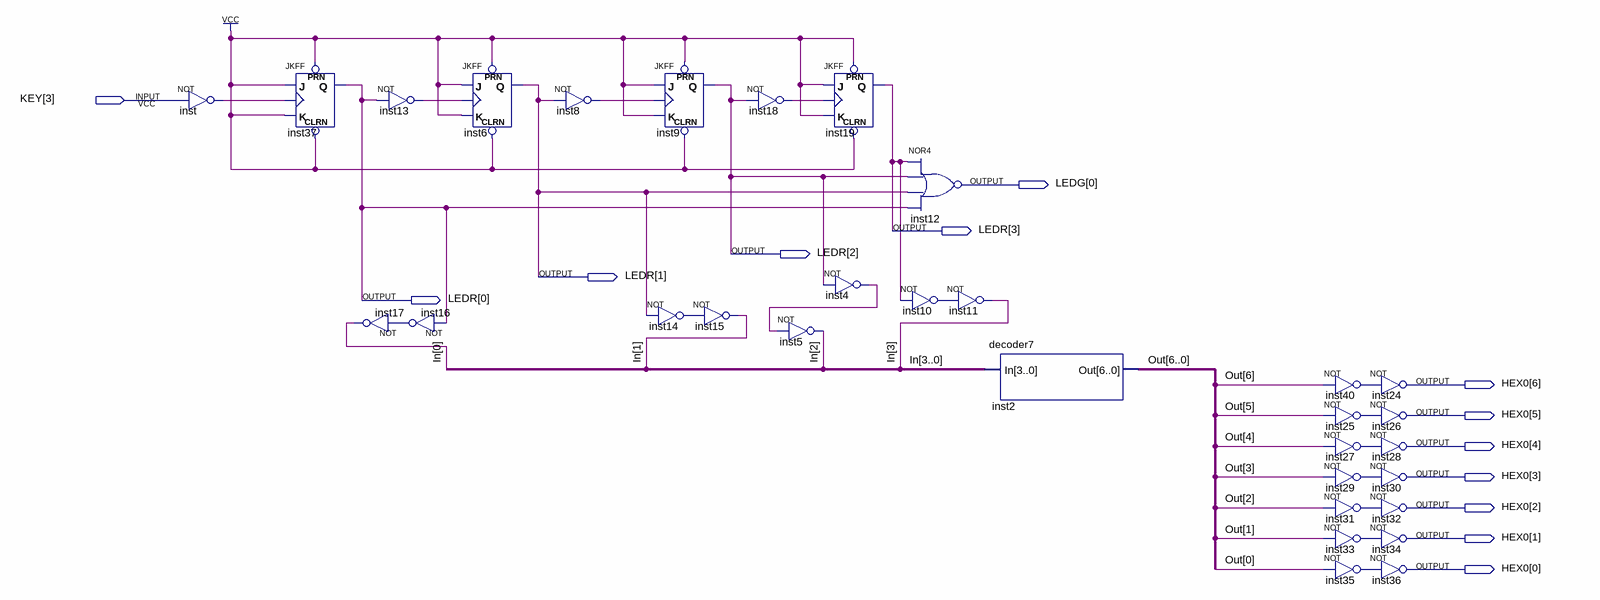
[diagram p0: schematic sheet]
// Quartus schematic Block1.bdf as structural Verilog: 32 symbols, 13 pins
module Block1 (
  input  [3:3] KEY,
  output [0:0] LEDG,
  output [3:0] LEDR,
  output [6:0] HEX0
);

  wire inst4_out, inst8_out, inst10_out, inst13_out, inst14_out, inst16_out, inst18_out, inst25_out,
       inst27_out, inst29_out, inst31_out, inst33_out, inst35_out, inst40_out, inst_out;
  wire [3:0] In;
  wire [6:0] Out;

  not inst (inst_out, KEY[3]);
  JKFF inst37 (.PRN(1'b1), .CLRN(1'b1), .K(1'b1), .J(1'b1), .CLK(inst_out), .Q(LEDR[0]));
  not inst17 (In[0], inst16_out);
  not inst13 (inst13_out, LEDR[0]);
  not inst16 (inst16_out, LEDR[0]);
  JKFF inst6 (.PRN(1'b1), .CLRN(1'b1), .K(1'b1), .J(1'b1), .CLK(inst13_out), .Q(LEDR[1]));
  not inst8 (inst8_out, LEDR[1]);
  JKFF inst9 (.PRN(1'b1), .CLRN(1'b1), .K(1'b1), .J(1'b1), .CLK(inst8_out), .Q(LEDR[2]));
  not inst14 (inst14_out, LEDR[1]);
  not inst15 (In[1], inst14_out);
  not inst18 (inst18_out, LEDR[2]);
  not inst5 (In[2], inst4_out);
  JKFF inst19 (.PRN(1'b1), .CLRN(1'b1), .K(1'b1), .J(1'b1), .CLK(inst18_out), .Q(LEDR[3]));
  not inst4 (inst4_out, LEDR[2]);
  nor inst12 (LEDG[0], LEDR[3], LEDR[2], LEDR[1], LEDR[0]);
  not inst10 (inst10_out, LEDR[3]);
  not inst11 (In[3], inst10_out);
  decoder7 inst2 (.In(In), .Out(Out));
  not inst40 (inst40_out, Out[6]);
  not inst25 (inst25_out, Out[5]);
  not inst27 (inst27_out, Out[4]);
  not inst29 (inst29_out, Out[3]);
  not inst31 (inst31_out, Out[2]);
  not inst33 (inst33_out, Out[1]);
  not inst35 (inst35_out, Out[0]);
  not inst24 (HEX0[6], inst40_out);
  not inst26 (HEX0[5], inst25_out);
  not inst28 (HEX0[4], inst27_out);
  not inst30 (HEX0[3], inst29_out);
  not inst32 (HEX0[2], inst31_out);
  not inst34 (HEX0[1], inst33_out);
  not inst36 (HEX0[0], inst35_out);
endmodule
